# Altium schematic sheet SEC_3002_HL_Power.SchDoc
size A3
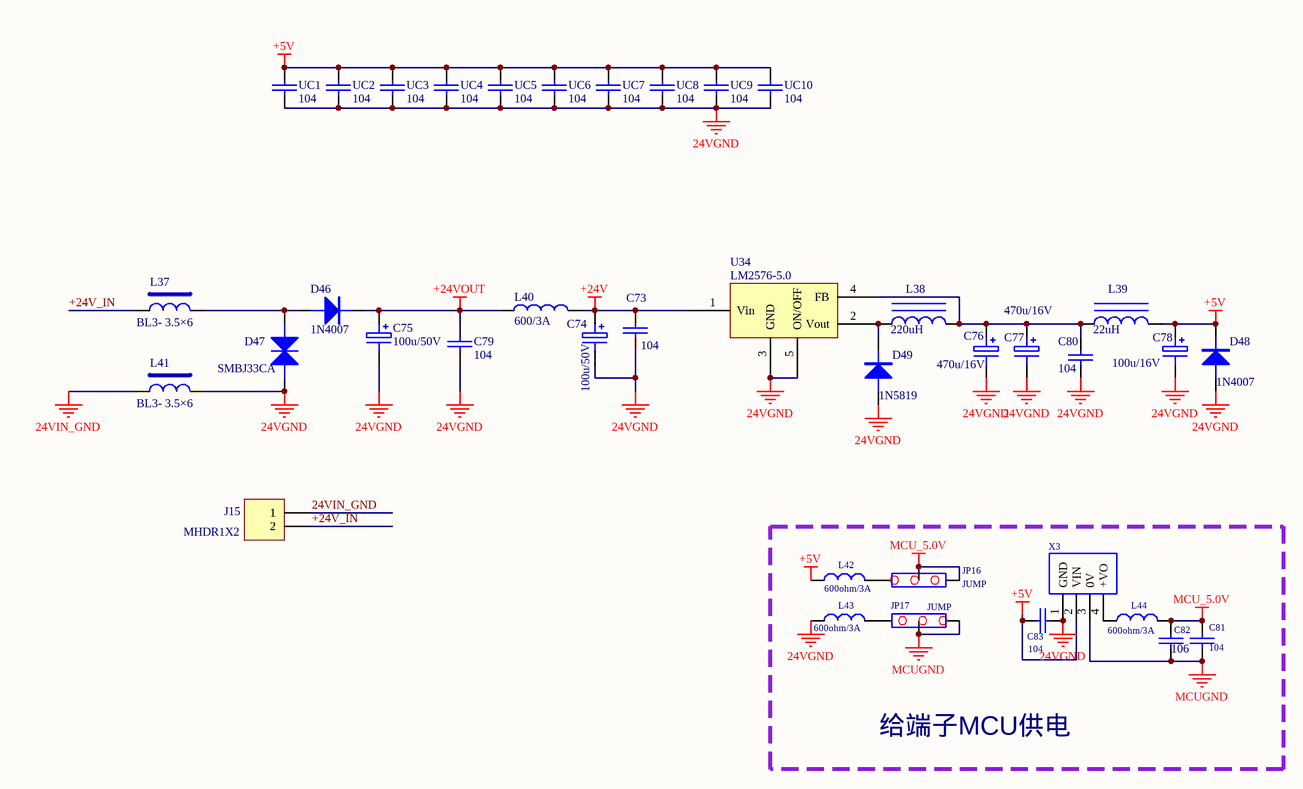
[diagram p0: SEC_3002_HL_Power.SchDoc]

## Parts
C73  104  [C-0603]
C74  100u/50V  [CAP-SMD-8*8*10]
C75  100u/50V  [CAP-SMD-8*8*10]
C76  470u/16V  [CAP-SMD-8*8*10]
C77  470u/16V  [CAP-SMD-8*8*10]
C78  100u/16V  [CAP-SMD-6.3]
C79  104  [C-0603]
C80  104  [C-0603]
C81  104  [C-0603]
C82  10V-106-±10%-[0805]  [C-0805]  (value not drawn)
C83  104  [C-0603]
D46  1N4007  [4526D]
D47  SMBJ33CA  [TVS-A]
D48  1N4007  [4526D]
D49  1N5819  [4526D]
J15  MHDR1X2  [6.35MM-2PIN]
JP16  JUMP  [SIP3]
JP17  JUMP  [SIP3]
L37  BL3- 3.5×6  [L_C]
L38  220uH  [L-7*7]
L39  22uH  [L-7*7]
L40  600/3A  [L-0805]
L41  BL3- 3.5×6  [L_C]
L42  value 600ohm/3A  [L-0805]  (hidden comment: BEAD)
L43  value 600ohm/3A  [L-0805]  (hidden comment: BEAD)
L44  value 600ohm/3A  [L-0805]  (hidden comment: BEAD)
U34  LM2576-5.0  [LM2576-5.0]
UC1  104  [C-0603]
UC2  104  [C-0603]
UC3  104  [C-0603]
UC4  104  [C-0603]
UC5  104  [C-0603]
UC6  104  [C-0603]
UC7  104  [C-0603]
UC8  104  [C-0603]
UC9  104  [C-0603]
UC10  104  [C-0603]
X3  B0505S-1WR2_  [B050S-1WR2]  (value not drawn)

## Blocks framed on the sheet
给端子MCU供电: C81-C83 JP16 JP17 L42-L44 X3

## Nets
24VGND: C73.2 C74.2 C75.2 C76.2 C77.2 C78.2 C79.2 C80.2 C83.2 D47.A D48.A D49.A L41.2 L43.1 U34.3(GND) U34.5(ON/OFF) UC1.2 UC2.2 UC3.2 UC4.2 UC5.2 UC6.2 UC7.2 UC8.2 UC9.2 UC10.2 X3.1(GND)
24VIN_GND: J15.1 L41.1
+5V: C78.1 C83.1 D48.K L39.1 L42.1 UC1.1 UC2.1 UC3.1 UC4.1 UC5.1 UC6.1 UC7.1 UC8.1 UC9.1 UC10.1 X3.2(VIN)
+24V: C73.1 C74.1 L40.2 U34.1(Vin)
+24VOUT: C75.1 C79.1 D46.K L40.1
MCU_5.0V: C81.1 C82.1 JP16.1 JP16.2 L44.2
MCUGND: C81.2 C82.2 JP17.2 JP17.3 X3.3(0V)
+24V_IN: J15.2 L37.1
NetC76_1: C76.1 C77.1 C80.1 L38.1 L39.2 U34.4(FB)
NetD46_A: D46.A D47.K L37.2
NetD49_K: D49.K L38.2 U34.2(Vout)
NetJP16_3: JP16.3 L42.2
NetJP17_1: JP17.1 L43.2
NetL44_1: L44.1 X3.4(+VO)

## Notes on the sheet
- (in symbol CAP) 106

## Library data of the parts
C73 C79-C83 UC1-UC10 = CAP: Capacitor
C74-C78 = ELECTRO1: Electrolytic Capacitor
D46 D48 D49 = DIODE_A: Diode
D47 = TVS
J15 = MHDR1X2: Header, 2-Pin; LatestRevisionDate: 17-Jul-2002; LatestRevisionNote: Re-released for DXP Platform.; Publisher: Altium Limited
L37 L41 = INDUCTOR
L38 L39 = INDUCTOR IRON
L40 = INDUCTOR1
L42-L44 = BEAD: 60Ω-3A-[0805]; NAME: 磁珠; PCB DECAL: 201209; Footprint: L0805
X3 = B0505S-1W: B050S-1WR; VALUE: B050S-1WR2; Name: 隔离电源模块; PCB DECAL: B050S-1WR2; Footprint: 见规格书